# EAGLE schematic start (EAGLE 6.6.0)
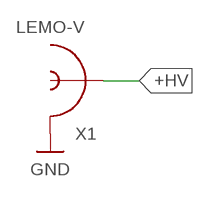
[diagram p0: schematic, sheet 1]

## Parts
X1  LEMO-V  [LEMO-V]

## Nets
+HV: X1.INNER
GND: X1.S1(SHIELD) X1.S2(SHIELD) X1.S3(SHIELD) X1.S4(SHIELD)

## Library data of the parts
X1 = local:LEMO